# EAGLE design SpaceFleaEPS (EAGLE 6.5.0)
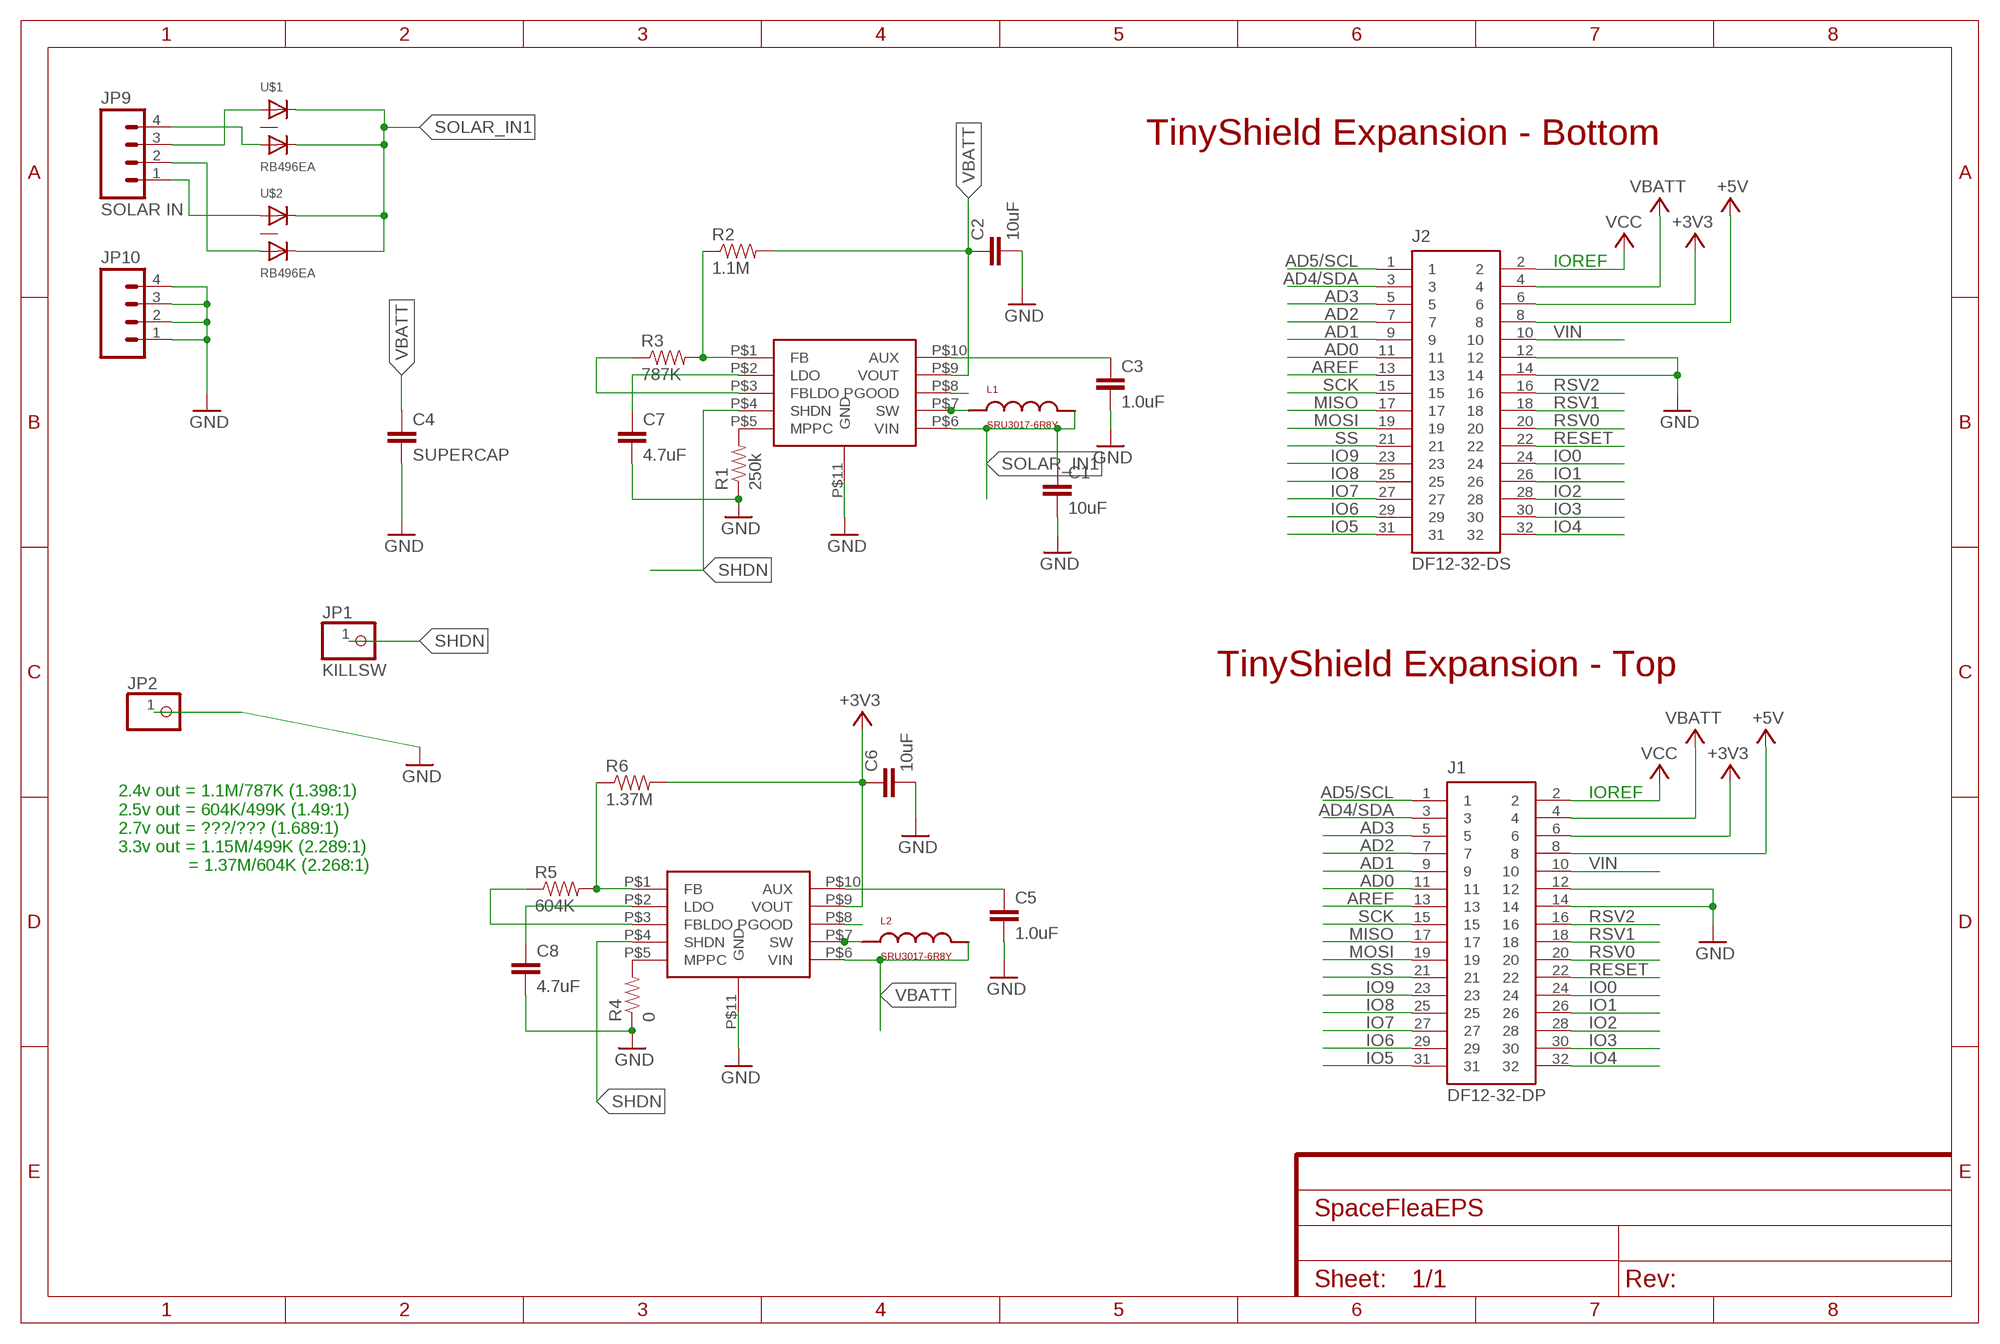
[diagram p0: schematic, sheet 1]

## Parts
C1  10uF  CAP0805  [0805]
C2  10uF  CAP0805  [0805]
C3  1.0uF  1.0UF-16V-10%(0603)  [0603-CAP]
C4  SUPERCAP  CAPPTH1  [CAP-PTH-5MM]
C5  1.0uF  1.0UF-16V-10%(0603)  [0603-CAP]
C6  10uF  CAP0805  [0805]
C7  4.7uF  CAP0603-CAP  [0603-CAP]
C8  4.7uF  CAP0603-CAP  [0603-CAP]
J1  DF12-32-DP  AS-ITM-00015  [DF12-32-DP]
J2  DF12-32-DS  AS-ITM-00012  [DF12-32-DS]
JP1  KILLSW  HEADER-1X12MM  [1X01_2MM]
JP2  HEADER-1X12MM  [1X01_2MM]
JP9  SOLAR IN  M041.27MM  [1X04-1.27MM]
JP10  M041.27MM  [1X04-1.27MM]
L1  SRU3017-6R8Y  [SRU3017-6R8Y]
L2  SRU3017-6R8Y  [SRU3017-6R8Y]
R1  250k  RESISTOR0402-RES  [0402-RES]
R2  1.1M  RESISTOR0402-RES  [0402-RES]
R3  787K  RESISTOR0402-RES  [0402-RES]
R4  0  RESISTOR0402-RES  [0402-RES]
R5  604K  RESISTOR0402-RES  [0402-RES]
R6  1.37M  RESISTOR0402-RES  [0402-RES]
U$1  RB496EA  [SOT23-5]
U$2  RB496EA  [SOT23-5]
U$3  LTC3105_DFN  [LTC3105DFN]
U$5  LTC3105_DFN  [LTC3105DFN]

## Nets
+3V3: C6.1 J1.6 J2.6 R6.2 U$3.P$9(VOUT)
+5V: J1.8 J2.8
AD0: J1.11 J2.11
AD1: J1.9 J2.9
AD2: J1.7 J2.7
AD3: J1.5 J2.5
AD4/SDA: J1.3 J2.3
AD5/SCL: J1.1 J2.1
AREF: J1.13 J2.13
GND: C1.2 C2.2 C3.2 C4.2 C5.2 C6.2 C7.2 C8.2 J1.12 J1.14 J2.12 J2.14 JP2.1 JP10.1 JP10.2 JP10.3 JP10.4 R1.1 R3.1 R4.1 R5.1 U$3.P$3(FBLDO) U$3.P$11(GND) U$5.P$3(FBLDO) U$5.P$11(GND)
IO0: J1.24 J2.24
IO1: J1.26 J2.26
IO2: J1.28 J2.28
IO3: J1.30 J2.30
IO4: J1.32 J2.32
IO5: J1.31 J2.31
IO6: J1.29 J2.29
IO7: J1.27 J2.27
IO8: J1.25 J2.25
IO9: J1.23 J2.23
MISO: J1.17 J2.17
MOSI: J1.19 J2.19
N$1: JP9.3 U$1.1
N$2: JP9.4 U$1.3
N$3: JP9.2 U$2.3
N$5: JP9.1 U$2.1
N$7: C3.1 U$5.P$10(AUX)
N$8: C7.1 U$5.P$2(LDO)
N$9: R4.2 U$3.P$5(MPPC)
N$10: R5.2 R6.1 U$3.P$1(FB)
N$11: U$3.P$8(PGOOD)
N$12: L2.P$1 U$3.P$7(SW)
N$13: R1.2 U$5.P$5(MPPC)
N$14: C5.1 U$3.P$10(AUX)
N$15: C8.1 U$3.P$2(LDO)
N$18: R2.1 R3.2 U$5.P$1(FB)
N$30: U$5.P$8(PGOOD)
N$37: L1.P$1 U$5.P$7(SW)
RESET: J1.22 J2.22
RSV0: J1.20 J2.20
RSV1: J1.18 J2.18
RSV2: J1.16 J2.16
SCK: J1.15 J2.15
SHDN: JP1.1 U$3.P$4(SHDN) U$5.P$4(SHDN)
SOLAR_IN1: C1.1 L1.P$2 U$1.4 U$1.5 U$2.4 U$2.5 U$5.P$6(VIN)
SS: J1.21 J2.21
VBATT: C2.1 C4.1 J1.4 J2.4 L2.P$2 R2.2 U$3.P$6(VIN) U$5.P$9(VOUT)
VCC: J1.2 J2.2
VIN: J1.10 J2.10
Unconnected: U$1.2 U$2.2

## Notes on the sheet
- TinyShield Expansion - Bottom
- IOREF
- TinyShield Expansion - Top
- IOREF
- 2.4v out = 1.1M/787K (1.398:1)
  2.5v out = 604K/499K (1.49:1)
  2.7v out = ???/??? (1.689:1)
  3.3v out = 1.15M/499K (2.289:1)
                = 1.37M/604K (2.268:1)

## Library data of the parts
C1 C2 C4 C6-C8 = SparkFun-Capacitors:CAP: Capacitor Standard 0603 ceramic capacitor, and 0.1" leaded capacitor.
C3 C5 = SparkFun-Capacitors:1.0UF-16V-10%(0603): CAP-00868; PROD_ID: CAP-00868
J1 = tinycircuits:AS-ITM-00015: CONN HEADER 32POS 3MM SMD 0.5MM; PARTNO: AS-ITM-00015
J2 = tinycircuits:AS-ITM-00012: CONN RECEPT 32POS 3MM SMD 0.5MM; PARTNO: AS-ITM-00012
JP1 JP2 = microbuilder:HEADER-1X1: PIN HEADER
JP9 JP10 = SparkFun-Connectors:M04: Header 4 Standard 4-pin 0.1" header. Use with straight break away headers (SKU : PRT-00116), right angle break away headers (PRT-00553), swiss pins (PRT-00743), machine pins (PRT-00117), and female headers (PRT-00115). Molex polarized connector foot print use with SKU : PRT-08231 with associated crimp pins and housings. 1MM SMD Version SKU: PRT-10208
L1 L2 = PQ_components:SRU3017-6R8Y: BOURNS SMD INDUCTOR SRU3017-6R8Y
R1-R6 = SparkFun-Passives:RESISTOR: Resistor Basic schematic elements and footprints for 0603, 1206, and PTH resistors.
U$1 U$2 = EduQube:RB496EA: ROHM RB496EA Schottky Barrier Diode
U$3 U$5 = PQ_components:LTC3105_DFN

## Board
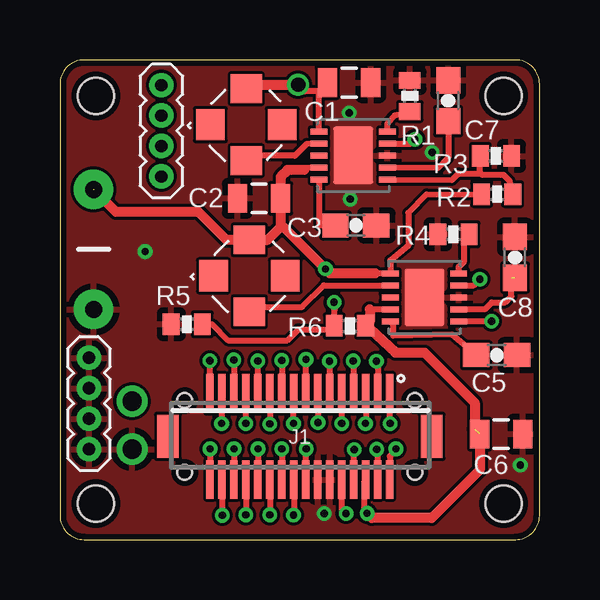
[diagram p1: board, top side]
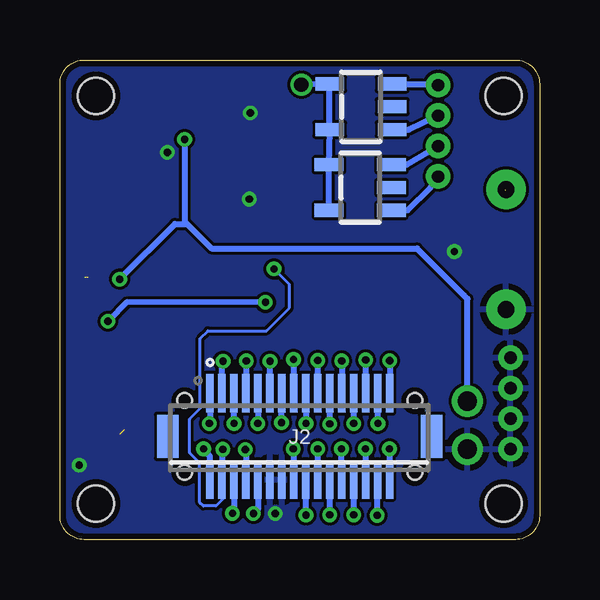
[diagram p2: board, bottom side, seen from below]

Size 20 x 20 mm. Coordinates in mm from the lower left corner, seen from the top.
Outline: 0,19 0,1 arc90 1,0 19,0 arc90 20,1 20,19 arc90 19,20 1,20 arc90 0,19
Copper layers (1*16): Top 0.035mm / dielectric 1.5mm / Bottom 0.035mm
Design rules "dirt_cheap_dirty_boards.v1": minimum track width 5mil, minimum drill 12mil, track to track 5mil, track to pad 5mil, pad to pad 5mil, via to via 5mil, smd to smd 0mil, copper to edge 10mil, drill to drill 10mil, minimum pad ring 10mil, minimum via ring 6mil, stop-mask expansion 2mil, vias tented up to drill 25mil, thermal gap 10mil
Holes 1.5 mm at 1.5,18.5 1.5,1.5 18.5,1.5 18.5,18.5

### Footprints (pad centres in the part's own frame; a part is rotated, then mirrored left to right if it is on the bottom)
0805 = smd 0.8 x 1.2: 1 -0.9,0; 2 0.9,0
0603-CAP = smd 1.1 x 1: 1 -0.85,0; 2 0.85,0
CAP-PTH-5MM = drill 0.7 pad 1.651: 1 -2.5,0; 2 2.5,0
DF12-32-DP = smd 0.3 x 1.6: 1 -3.75,-1.8; 2 -3.75,1.8; 3 -3.25,-1.8; 4 -3.25,1.8; 5 -2.75,-1.8; 6 -2.75,1.8; 7 -2.25,-1.8; 8 -2.25,1.8; 9 -1.75,-1.8; 10 -1.75,1.8; 11 -1.25,-1.8; 12 -1.25,1.8; 13 -0.75,-1.8; 14 -0.75,1.8; 15 -0.25,-1.8; 16 -0.25,1.8; 17 0.25,-1.8; 18 0.25,1.8; 19 0.75,-1.8; 20 0.75,1.8; 21 1.25,-1.8; 22 1.25,1.8; 23 1.75,-1.8; 24 1.75,1.8; 25 2.25,-1.8; 26 2.25,1.8; 27 2.75,-1.8; 28 2.75,1.8; 29 3.25,-1.8; 30 3.25,1.8; 31 3.75,-1.8; 32 3.75,1.8 | smd 0.9 x 1.8: F1 -5.5,0; F2 5.5,0 | hole 0.6: -4.8,1.5; 4.8,1.5
DF12-32-DS = smd 0.3 x 1.6: 1 -3.75,1.8; 2 -3.75,-1.8; 3 -3.25,1.8; 4 -3.25,-1.8; 5 -2.75,1.8; 6 -2.75,-1.8; 7 -2.25,1.8; 8 -2.25,-1.8; 9 -1.75,1.8; 10 -1.75,-1.8; 11 -1.25,1.8; 12 -1.25,-1.8; 13 -0.75,1.8; 14 -0.75,-1.8; 15 -0.25,1.8; 16 -0.25,-1.8; 17 0.25,1.8; 18 0.25,-1.8; 19 0.75,1.8; 20 0.75,-1.8; 21 1.25,1.8; 22 1.25,-1.8; 23 1.75,1.8; 24 1.75,-1.8; 25 2.25,1.8; 26 2.25,-1.8; 27 2.75,1.8; 28 2.75,-1.8; 29 3.25,1.8; 30 3.25,-1.8; 31 3.75,1.8; 32 3.75,-1.8 | smd 0.9 x 1.8: F1 -5.5,0; F2 5.5,0 | hole 0.6: -4.8,1.5; 4.8,1.5
1X01_2MM = drill 0.8 pad 1.27: 1 0,0
1X04-1.27MM = drill 0.508 pad 1: 1 0,0; 2 1.27,0; 3 2.54,0; 4 3.81,0
SRU3017-6R8Y = smd 1.3 x 1.2 rotated 45: P$1 1.061,-1.061; P$2 -1.061,1.061 | smd 1.3 x 1.2 rotated 135: P$3 -1.061,-1.061; P$4 1.061,1.061
0402-RES = smd 0.7 x 0.9: 1 -0.65,0; 2 0.65,0
SOT23-5 = smd 0.55 x 1.2: 1 -0.95,-1.3; 2 0,-1.3; 3 0.95,-1.3; 4 0.95,1.3; 5 -0.95,1.3
LTC3105DFN = smd 0.25 x 0.7: P$1 -1,-1.425; P$2 -0.5,-1.425; P$3 0,-1.425; P$4 0.5,-1.425; P$5 1,-1.425; P$6 1,1.425; P$7 0.5,1.425; P$8 0,1.425; P$9 -0.5,1.425; P$10 -1,1.425 | smd 2.38 x 1.65: P$11 0,0

### Placement (x,y rotation side)
C1  12.06,19.05 0 top
C2  8.3,14.23 180 top
C3  12.34,13.1 0 top
C4  1.4,12.1 270 top
C5  18.21,7.69 0 top
C6  18.4,4.4 0 top
C7  16.19,18.3 90 top
C8  18.97,11.77 90 top
J1  10,4.3 180 top
J2  10,4.3 0 bottom
JP1  3.01,5.77 0 top
JP2  3.01,3.77 0 top
JP9  4.23,15.14 90 top
JP10  1.21,3.77 90 top
L1  7.77,17.3 315 top
L2  7.9,11 315 top
R1  14.59,18.5 270 top
R2  18.23,14.4 180 top
R3  18.18,16 180 top
R4  16.41,12.73 0 top
R5  5.29,8.98 0 top
R6  12.09,8.91 0 top
U$1  7.45,18.05 90 bottom
U$2  7.48,14.68 90 bottom
U$3  15.2,10.1 90 top
U$5  12.23,16.02 90 top

### Tracks (layer width: path | path; a pad name or v marks a point on that pad's centre or on a via)
+3V3  (via drill 0.3)  (1 unrouted)
  Top 0.254: U$3.P$9 12.92,9.6 | J1.6 12.7,2.45 12.7,1.2 v12.8,1.09 12.85,1.05 | 12.92,9.09 R6.2 12.87,8.79 12.92,8.79
  Top 0.406: 12.92,8.79 13.98,7.8 15.2,7.8 17.3,5.7 17.3,4.6 | C6.1 17.5,2.9 15.5,0.9 13,0.9 12.85,1.05 | 12.92,9.6 12.92,9.09
  Bottom 0.254: J1.6 12.75,1.15 v12.8,1.09
+5V  (via drill 0.3)
  Top 0.254: J1.8 12.27,2.52 v12.27,3.75
  Bottom 0.254: v12.27,3.75 12.25,3.73 J1.8
AD0  (via drill 0.3)
  Top 0.254: v11.24,7.44 J1.11
  Bottom 0.254: J1.11 v11.25,7.43 v11.24,7.44
AD1  (via drill 0.3)
  Top 0.254: v11.75,4.84 J1.9
  Bottom 0.254: J1.9 v11.75,4.84
AD2  (via drill 0.3)
  Top 0.254: J1.7 12.25,7.43 v12.23,7.45
  Bottom 0.254: v12.23,7.45 12.23,6.12 J1.7
AD3  (via drill 0.3)
  Top 0.254: J1.5 12.75,4.81 v12.74,4.84
  Bottom 0.254: v12.74,4.84 12.74,5.8 J1.5
AD4/SDA  (via drill 0.3)
  Top 0.254: v13.2,7.44 13.25,7.39 J1.3
  Bottom 0.254: J1.3 13.25,7.39 v13.2,7.44
AD5/SCL  (via drill 0.3)
  Top 0.254: v13.77,4.84 13.77,6.1 J1.1
  Bottom 0.254: J1.1 13.75,4.8 v13.77,4.84
AREF  (via drill 0.3)
  Top 0.254: J1.13 10.76,4.84 v10.76,4.87
  Bottom 0.254: v10.76,4.87 J1.13
GND  (via drill 0.3)
  other vias: 12.06,17.79 19.2,3.1 12.1,14.2 3.55,12.01 11.02,1.08 15.52,16.14
  pour Top: 0,19 0,1 arc90 1,0 19,0 arc90 20,1 20,19 arc90 19,20 1,20 arc90
  pour Bottom: 0,19 0,1 arc90 1,0 19,0 arc90 20,1 20,19 arc90 19,20 1,20 arc90
IO0  (via drill 0.3)
  Top 0.254: v8.26,3.78 8.25,3.86 J1.24
  Bottom 0.254: J1.24 v8.26,3.78
IO1  (via drill 0.3)
  Top 0.254: J1.26 v7.75,1.03
  Bottom 0.254: v7.75,1.03 J1.26
IO2  (via drill 0.3)
  Top 0.254: v7.26,3.78 J1.28
  Bottom 0.254: J1.28 7.25,3.76 v7.26,3.78
IO3  (via drill 0.3)
  Top 0.254: J1.30 6.75,1.01 v6.77,1.01
  Bottom 0.254: v6.77,1.01 6.77,2.5 J1.30
IO4  (via drill 0.3)
  Top 0.254: v6.26,3.78 J1.32
  Bottom 0.254: J1.32 6.25,3.88 v6.26,3.78
IO5  (via drill 0.3)
  Top 0.254: J1.31 v6.25,7.46
  Bottom 0.254: v6.25,7.46 J1.31
IO6  (via drill 0.3)
  Top 0.254: J1.29 v6.74,4.85 v6.74,4.84
  Bottom 0.254: v6.74,4.84 J1.29
IO7  (via drill 0.3)
  Top 0.254: v7.25,7.49 J1.27
  Bottom 0.254: J1.27 v7.25,7.49
IO8  (via drill 0.3)
  Top 0.254: v7.75,4.84 7.74,6.19 J1.25
  Bottom 0.254: J1.25 7.76,4.98 v7.75,4.84
IO9  (via drill 0.3)
  Top 0.254: J1.23 v8.25,7.45
  Bottom 0.254: v8.25,7.45 J1.23
MISO  (via drill 0.3)
  Top 0.254: v9.74,4.84 J1.17
  Bottom 0.254: J1.17 v9.75,4.85 v9.74,4.84
MOSI  (via drill 0.3)
  Top 0.254: v9.25,7.47 J1.19
  Bottom 0.254: J1.19 v9.25,7.47
N$1
  Bottom 0.254: U$1.1 5.45,17.09 JP9.3
N$2
  Bottom 0.254: U$1.3 4.67,18.99 JP9.4
N$3
  Bottom 0.254: U$2.3 5.55,15.63 JP9.2
N$5
  Bottom 0.254: U$2.1 5.49,13.73 4.55,14.66 JP9.1
N$7
  Top 0.254: U$5.P$10 10.8,13.11 C3.1
N$8
  Top 0.254: C7.1 16.19,15.92 15.77,15.5 U$5.P$2
N$9
  Top 0.254: U$3.P$5 16.62,11.37 16.86,11.6 16.86,12.59 R4.2
N$10  (via drill 0.3)
  Top 0.254: v11.43,9.89 11.45,9.58 R6.1 11.3,8.77 9.94,8.77 9.48,8.31 7.01,8.31 6.34,8.98 R5.2 | v18,9.1 U$3.P$1
  Bottom 0.254: v11.43,9.89 17.2,9.9 v18,9.1
N$12
  Top 0.254: L2.P$1 7.9,9.7 10.1,9.7 11,10.6 U$3.P$7
N$13
  Top 0.254: U$5.P$5 13.66,17.37 13.96,17.69 R1.2
N$14
  Top 0.254: C5.1 16.35,8.55 13.9,8.5 13.9,8.97 U$3.P$10
N$15  (1 unrouted)
  Top 0.254: U$3.P$2 17.71,9.6 18,9.89 18.57,9.89 18.83,10.15 18.83,10.93
N$18
  Top 0.254: R2.1 18.75,14.95 18.5,15.2 17.6,15.2 17.5,15.3 | 17.5,15.3 17.5,15.95 R3.2 | U$5.P$1 16.35,15 16.62,15.27 17.47,15.27 17.5,15.3
N$37
  Top 0.254: U$5.P$7 10.29,16.5 9.8,16.01 7.81,16.01 L1.P$1
RESET  (via drill 0.3)
  Top 0.254: J1.22 v8.75,1.03
  Bottom 0.254: v8.75,1.03 J1.22
RSV0  (via drill 0.3)
  Top 0.254: v9.25,3.78 J1.20
  Bottom 0.254: J1.20 v9.25,3.78
RSV1  (via drill 0.3)
  Top 0.254: J1.18 9.75,0.83 v9.74,1.02
  Bottom 0.254: v9.74,1.02 9.75,1.08 J1.18
RSV2  (via drill 0.3)
  Top 0.254: J1.16 10.25,3.84 v10.27,3.78
  Bottom 0.254: v10.27,3.78 10.27,2.5 J1.16
SCK  (via drill 0.3)
  Top 0.254: J1.15 v10.25,7.5 v10.26,7.51
  Bottom 0.254: v10.26,7.51 J1.15
SHDN  (via drill 0.3)
  Top 0.254: U$5.P$4 14.63,16.52 v14.8,16.69 | U$3.P$4 17.25,10.6 v17.51,10.86
  Bottom 0.254: v14.8,16.69 14.8,13.26 14.71,13.16 | 14.71,13.16 13.68,12.14 5.11,12.14 3.22,10.25 3.15,10.18 3.01,10.04 JP1.1 | v17.51,10.86 15.21,13.16 14.71,13.16
SOLAR_IN1  (via drill 0.6)
  Top 0.254: U$5.P$6 10.8,18.7 | 10.8,18.7 C1.1 | 10.8,18.7 10.21,18.7 v9.93,18.97
  Top 0.406: L1.P$2 7.6,18.97 v9.93,18.97
  Bottom 0.254: U$2.5 U$2.4 8.74,17.04 U$1.5 U$1.4 v9.93,18.97
SS  (via drill 0.3)
  Top 0.254: J1.21 8.76,4.89 v8.75,4.82
  Bottom 0.254: v8.75,4.82 J1.21
VBATT  (via drill 0.3)  (1 unrouted)
  Top 0.254: J1.4 13.25,3.72 v13.21,3.76 | U$5.P$9 10.27,15.5 10.18,15.41 | 13.14,11.11 U$3.P$6 13.78,11.64 14.53,12.26 14.53,13.62 15.29,14.39 R2.2
  Top 0.406: 10.18,15.41 9.48,15.41 9.2,15.13 C2.1 9.2,13.16 9.26,13.1 | 9.26,13.1 v11.07,11.29 11.25,11.11 13.14,11.11 | 9.26,13.1 8.66,12.5 L2.P$2 6.94,12.5 5.77,13.67 2.33,13.67 1.42,14.58
  Bottom 0.127: v13.21,3.76 13.21,1.68 13.49,1.4 14.02,1.4 14.17,1.55 14.17,3.2 14.59,3.62 14.59,5.03 14.15,5.47 14.15,8.38 13.83,8.7 11.39,8.7 10.43,9.66 10.43,10.64 v11.07,11.29
  Bottom 0.254: v13.21,3.76 13.25,3.72 J1.4
VCC  (via drill 0.3)
  Top 0.254: v14.01,3.78 13.75,3.47 J1.2
  Bottom 0.254: J1.2 13.75,3.47 v14.01,3.78
VIN  (via drill 0.3)
  Top 0.254: v11.93,1.08 11.75,1.26 J1.10
  Bottom 0.254: J1.10 11.75,1.26 v11.93,1.08